# Altium schematic sheet project_team_result.SchDoc
size A4
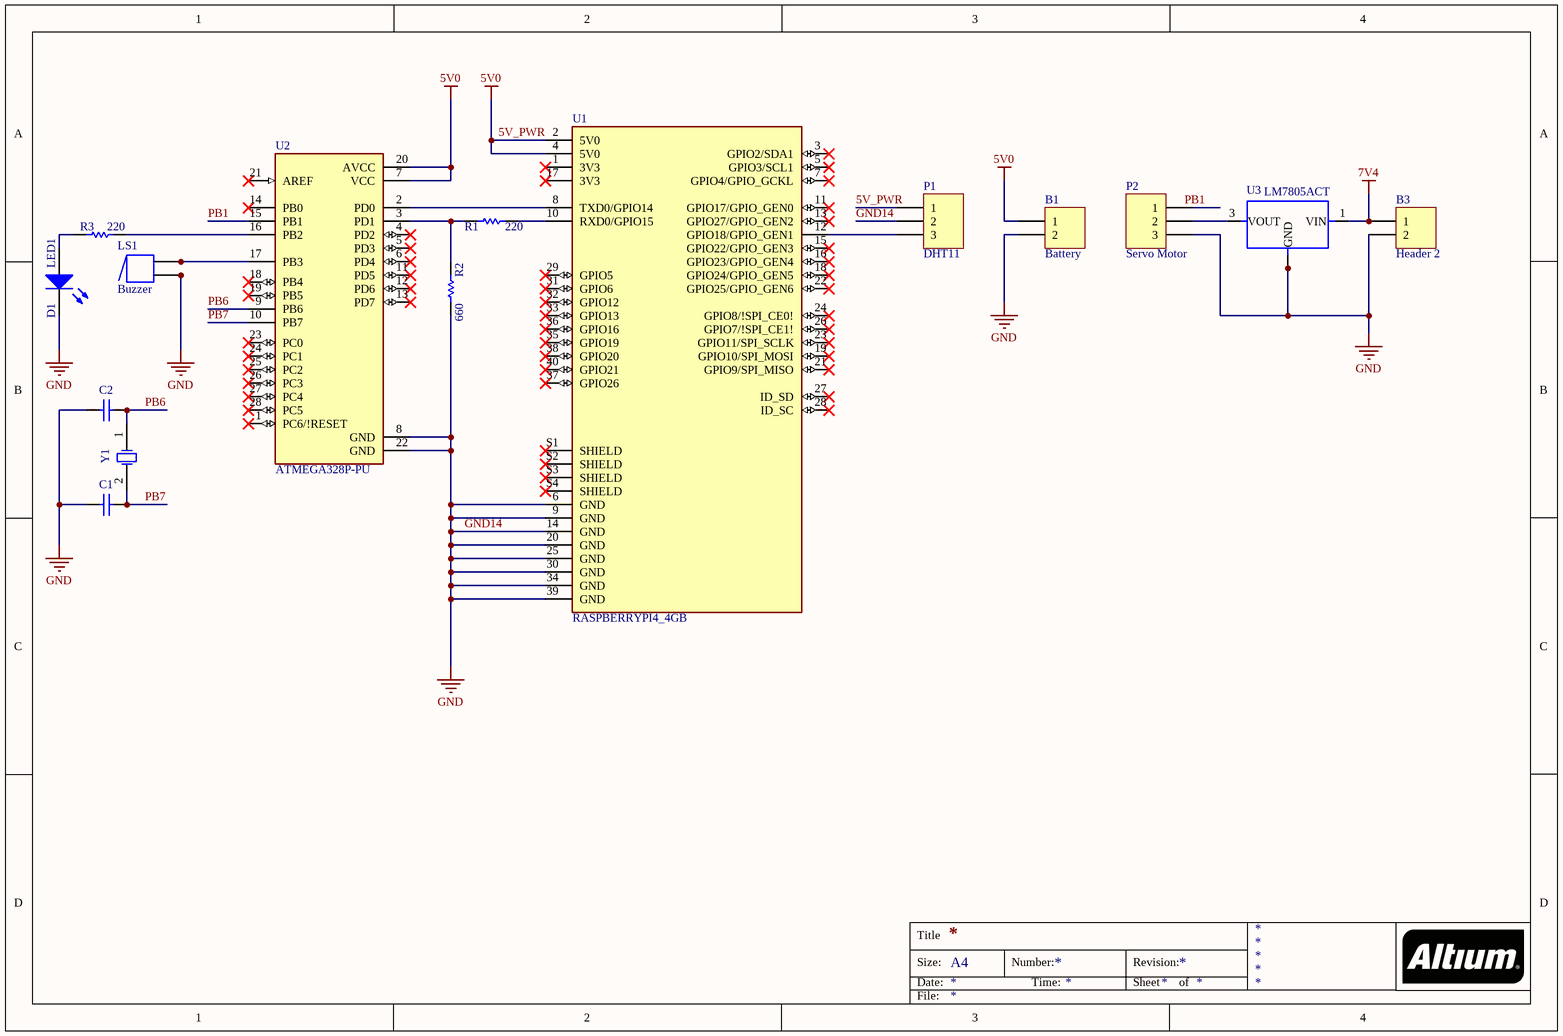
[diagram p0: project_team_result.SchDoc]

## Parts
B1  Battery  [HDR1X2]
B3  Header 2  [HDR1X2]
C1  Cap  [RAD-0.3]  (value not drawn)
C2  Cap  [RAD-0.3]  (value not drawn)
D1  LED1  [LED-1]
LS1  Buzzer  [ABSM-1574]
P1  DHT11  [HDR1X3]
P2  Servo Motor  [HDR1X3]
R1  value 220  [AXIAL-0.3]  (hidden comment: Res1)
R2  value 660  [AXIAL-0.3]  (hidden comment: Res1)
R3  value 220  [AXIAL-0.3]  (hidden comment: Res1)
U1  RASPBERRYPI4_4GB  [MODULE_RASPBERRYPI4_4GB]
U2  ATMEGA328P-PU  [DIP794W46P254L2967H457Q28B]
U3  LM7805ACT  [TO-220]
Y1  XTAL  [R38]  (value not drawn)

## Nets
5V_PWR: B1.1 P1.1 U1.2(5V0) U1.4(5V0) U2.7(VCC) U2.20(AVCC)  [also labelled 5V0]
7V4: B3.1 U3.1(VIN)
GND14: B1.2 B3.2 C1.2 C2.1 D1.2(K) LS1.2 LS1.2A P1.2 P2.3 R2.2 U1.6(GND) U1.9(GND) U1.14(GND) U1.20(GND) U1.25(GND) U1.30(GND) U1.34(GND) U1.39(GND) U2.8(GND) U2.22(GND) U3.2(GND) U3.HEAT(GND)  [also labelled GND]
PB1: P2.1 U2.15(PB1)
PB6: C2.2 U2.9(PB6) Y1.1(OSC1)
PB7: C1.1 U2.10(PB7) Y1.2(OSC2)
NetD1_1: D1.1(A) R3.1
NetLS1_1: LS1.1 LS1.1A U2.17(PB3)
NetP1_3: P1.3 U1.12(GPIO18/GPIO_GEN1)
NetP2_2: P2.2 U3.3(VOUT)
NetR1_1: R1.1 R2.1 U2.3(PD1)
NetR1_2: R1.2 U1.10(RXD0/GPIO15)
NetR3_2: R3.2 U2.16(PB2)
NetU1_8: U1.8(TXD0/GPIO14) U2.2(PD0)

Not connected (* = marked no-connect by the designer): U1 1(3V3)* 3(GPIO2/SDA1)* 5(GPIO3/SCL1)* 7(GPIO4/GPIO_GCKL)* 11(GPIO17/GPIO_GEN0)* 13(GPIO27/GPIO_GEN2)* 15(GPIO22/GPIO_GEN3)* 16(GPIO23/GPIO_GEN4)* 17(3V3)* 18(GPIO24/GPIO_GEN5)* 19(GPIO10/SPI_MOSI)* 21(GPIO9/SPI_MISO)* 22(GPIO25/GPIO_GEN6)* 23(GPIO11/SPI_SCLK)* 24(GPIO8/!SPI_CE0!)* 26(GPIO7/!SPI_CE1!)* 27(ID_SD)* 28(ID_SC)* 29(GPIO5)* 31(GPIO6)* 32(GPIO12)* 33(GPIO13)* 35(GPIO19)* 36(GPIO16)* 37(GPIO26)* 38(GPIO20)* 40(GPIO21)* S1(SHIELD)* S2(SHIELD)* S3(SHIELD)* S4(SHIELD)*; U2 1(PC6/!RESET)* 4(PD2)* 5(PD3)* 6(PD4)* 11(PD5)* 12(PD6)* 13(PD7)* 14(PB0)* 18(PB4)* 19(PB5)* 21(AREF)* 23(PC0)* 24(PC1)* 25(PC2)* 26(PC3)* 27(PC4)* 28(PC5)*

## Notes on the sheet
- Title
- Size:
- Date:
- A4
- Number:
- Time:
- Revision:
- Sheet
- of
- File:

## Library data of the parts
B1 B3 = Header 2: Header, 2-Pin; LatestRevisionDate: 17-Jul-2002; LatestRevisionNote: Re-released for DXP Platform.; Publisher: Altium Limited
C1 C2 = Cap: Capacitor; Value: 100pF; Published: 8-Jun-2000; LatestRevisionDate: 17-Jul-2002; LatestRevisionNote: Re-released for DXP Platform.; PackageReference: RAD-0.3; Publisher: Altium Limited; PackageDescription: Radial Cap, Thru-Hole; 2 Leads; 0.3 in Pin Spacing
D1 = LED1: Typical RED GaAs LED; Published: 8-Jun-2000; LatestRevisionDate: 08-Jul-2005; LatestRevisionNote: Mech Layer 1 removed.; PackageReference: LED-1; Publisher: Altium Limited; PackageDescription: LED; 2 Leads
LS1 = Buzzer: Magnetic Transducer Buzzer; Published: 24-Mar-1999; LatestRevisionDate: 17-Dec-2003; LatestRevisionNote: Schematic revised, PCB Footprint replaced.; DatasheetVersion: 17-Dec-2003; PackageReference: ABSM-1574; Publisher: Altium Limited; PackageDescription: Magnetic Transducer Buzzer; ComponentLink1Description: Manufacturer Link; ComponentLink1URL: http://www.megastar.com/linecard/buzzmode/index.php
P1 P2 = Header 3: Header, 3-Pin; LatestRevisionDate: 17-Jul-2002; LatestRevisionNote: Re-released for DXP Platform.; Publisher: Altium Limited
R1-R3 = Res1: Resistor; Published: 8-Jun-2000; LatestRevisionDate: 17-Jul-2002; LatestRevisionNote: Re-released for DXP Platform.; PackageReference: AXIAL-0.3; Publisher: Altium Limited; PackageDescription: Axial Device, Thru-Hole; 2 Leads; 0.3 in Pin Spacing
U1 = RASPBERRYPI4_4GB: BCM2711 Raspberry Pi 4 Model B 4GB - ARMÂ® CortexÂ®-A72 MPU Embedded Evaluation Board; MF: Raspberry Pi Foundation (NF); MP: RASPBERRYPI4 4GB; Price: None; Availability: Unavailable; Package: None; SnapEDA_Link: https://www.snapeda.com/parts/RASPBERRYPI4%204GB/Raspberry%20Pi/view-part/3832294/?ref=snap; Value: *; BuyPart: https://www.snapeda.com/parts/RASPBERRYPI4%204GB/Raspberry%20Pi/view-part/3832294/?ref=eda
U2 = ATMEGA328P-PU: AVR AVRÂ® ATmega Microcontroller IC 8-Bit 20MHz 32KB _16K x 16_ FLASH 28-PDIP; MF: Microchip; Package: PDIP-28 Atmel; Value: *; Availability: Unavailable; SnapEDA_Link: https://www.snapeda.com/parts/ATMEGA328P-PU/Microchip/view-part/44282/?ref=snap; Price: None; MP: ATMEGA328P-PU
U3 = PMIC-LM7805ACT(TO-220): Linear Voltage Regulator IC 1 Output 1A TO-220-3; MF: ON Semiconductor; Price: None; Availability: Unavailable; Value: *; MP: LM7805ACT; SnapEDA_Link: https://www.snapeda.com/parts/LM7805ACT/ON%20Semiconductor/view-part/1402456/?ref=snap; Package: TO-220 ON Semiconductor
Y1 = XTAL: Crystal Oscillator; Published: 8-Jun-2000; LatestRevisionDate: 17-Jul-2002; LatestRevisionNote: Re-released for DXP Platform.; PackageReference: R38; Publisher: Altium Limited; PackageDescription: Crystal, Thru-Hole; 2 Leads; Body 3.1 x 8.2 mm (Dia.xH)